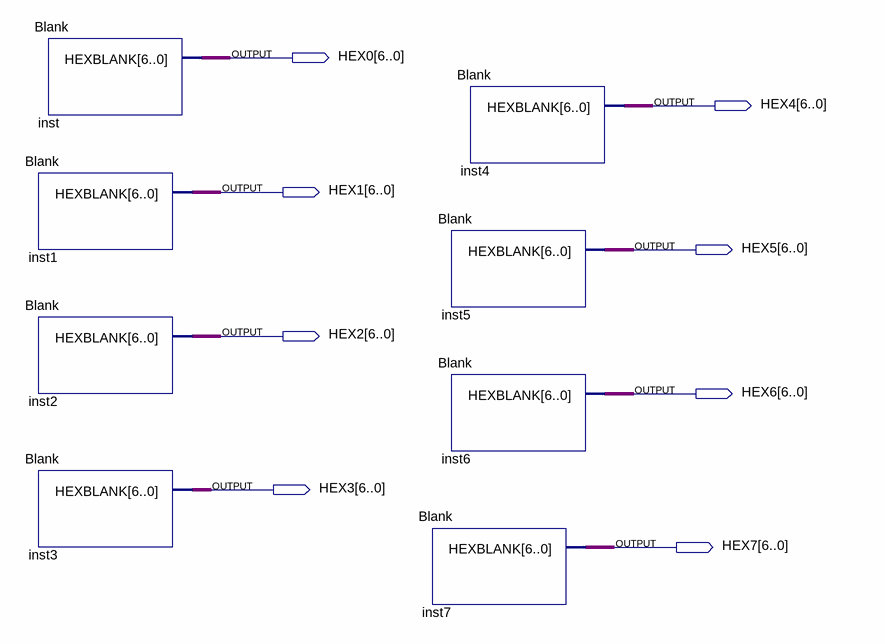
[diagram p0: schematic sheet]
// Quartus schematic Display_All_Blank.bdf as structural Verilog: 8 symbols, 8 pins
module Display_All_Blank (
  output [6:0] HEX0,
  output [6:0] HEX4,
  output [6:0] HEX1,
  output [6:0] HEX5,
  output [6:0] HEX2,
  output [6:0] HEX6,
  output [6:0] HEX3,
  output [6:0] HEX7
);

  Blank inst (.HEXBLANK(HEX0));
  Blank inst1 (.HEXBLANK(HEX1));
  Blank inst2 (.HEXBLANK(HEX2));
  Blank inst3 (.HEXBLANK(HEX3));
  Blank inst5 (.HEXBLANK(HEX5));
  Blank inst6 (.HEXBLANK(HEX6));
  Blank inst7 (.HEXBLANK(HEX7));
  Blank inst4 (.HEXBLANK(HEX4));
endmodule
